# EAGLE schematic cyberstick3_rec (EAGLE 7.4.0)
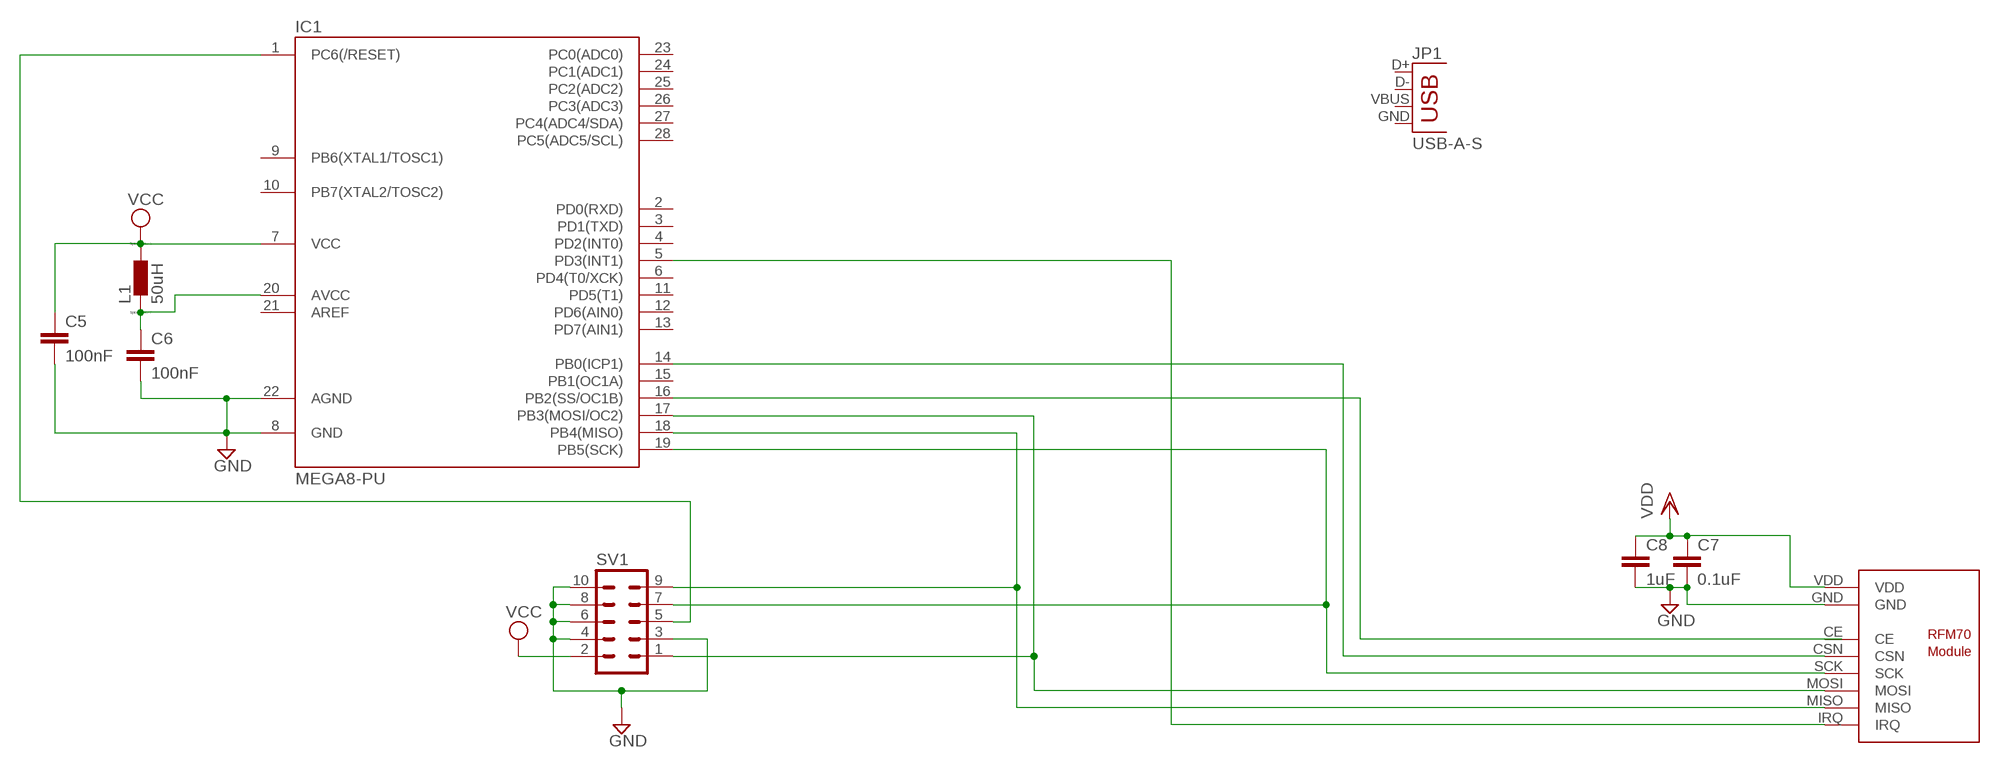
[diagram p0: schematic, sheet 1]

## Parts
C5  100nF  C2,5-3  [C2.5-3]
C6  100nF  C2,5-3  [C2.5-3]
C7  0.1uF  C2,5-3  [C2.5-3]
C8  1uF  C2,5-3  [C2.5-3]
IC1  MEGA8-PU  [DIL28-3]
JP1  USB-A-S  [USB-A-S]
L1  50uH  L0204/7  [0204/7]
SV1  MA05-2  [MA05-2]
U$2  RFM70  [RFM70]

## Nets
GND: C5.2 C6.2 C7.2 C8.2 IC1.8(GND) IC1.22(AGND) SV1.3 SV1.4 SV1.6 SV1.8 SV1.10 U$2.GND
N$1: IC1.16(PB2(SS/OC1B))
N$2: IC1.5(PD3(INT1)) U$2.IRQ
N$3: IC1.19(PB5(SCK)) SV1.7 U$2.SCK
N$5: IC1.14(PB0(ICP1)) U$2.CSN
N$8: IC1.17(PB3(MOSI/OC2)) SV1.1 U$2.MOSI
N$9: IC1.1(PC6(/RESET)) SV1.5
N$15: IC1.18(PB4(MISO)) SV1.9 U$2.MISO
N$18: C6.1 IC1.20(AVCC) L1.2
VCC: C5.1 IC1.7(VCC) L1.1 SV1.2
VDD: C7.1 C8.1 U$2.VDD
Unconnected: IC1.2(PD0(RXD)) IC1.3(PD1(TXD)) IC1.4(PD2(INT0)) IC1.6(PD4(T0/XCK)) IC1.9(PB6(XTAL1/TOSC1)) IC1.10(PB7(XTAL2/TOSC2)) IC1.11(PD5(T1)) IC1.12(PD6(AIN0)) IC1.13(PD7(AIN1)) IC1.15(PB1(OC1A)) IC1.21(AREF) IC1.23(PC0(ADC0)) IC1.24(PC1(ADC1)) IC1.25(PC2(ADC2)) IC1.26(PC3(ADC3)) IC1.27(PC4(ADC4/SDA)) IC1.28(PC5(ADC5/SCL)) JP1.D+ JP1.D- JP1.GND JP1.VBUS U$2.CE

## Library data of the parts
C5-C8 = capacitor-wima:C: CAPACITOR naming: grid - package width
IC1 = avr-7:MEGA8-PU
JP1 = SparkFun-Connectors:USB: USB Connectors USB-B-PTH is fully proven SKU : PRT-00139/CONN-08278 USB-miniB is fully proven SKU : PRT-00587 USB-A-PCB is untested. USB-A-H is throughly reviewed, but untested. Spark Fun Electronics SKU : PRT-00437 USB-B-SMT is throughly reviewed, but untested. Needs silkscreen touching up. USB-A-S has not been used/tested USB-MB-H has not been used/tested USB-MICROB has been used. CONN-09505
L1 = eagle-ltspice:L: INDUCTOR, European symbol; SPICEMODEL: NONE; SPICEPREFIX: L
SV1 = con-lstb:MA05-2: PIN HEADER; OC_FARNELL: unknown; OC_NEWARK: unknown
U$2 = Ulli:RFM70: RFM70 2.4 Ghz Funkmodul Autor: Daniel Weber Website: http://projects.web4clans.com Email: daniel.weber@web4clans.com